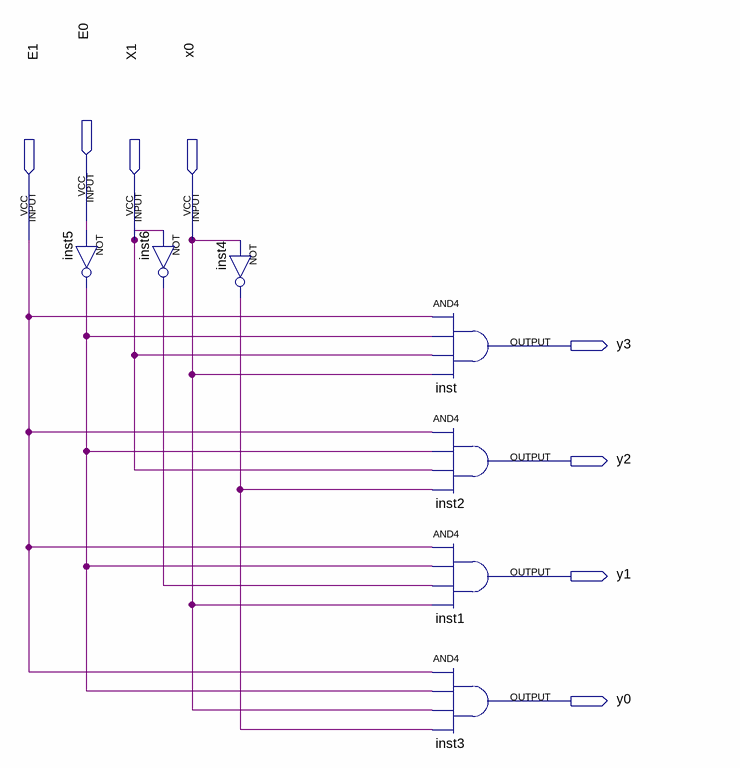
[diagram p0: schematic sheet]
// Quartus schematic Dec2_4.bdf as structural Verilog: 7 symbols, 8 pins
module Dec2_4 (
  input  E0,
  input  E1,
  input  X1,
  input  x0,
  output y3,
  output y2,
  output y1,
  output y0
);

  wire inst4_out, inst5_out, inst6_out;

  not inst5 (inst5_out, E0);
  not inst6 (inst6_out, X1);
  not inst4 (inst4_out, x0);
  and inst (y3, E1, inst5_out, X1, x0);
  and inst2 (y2, E1, inst5_out, X1, inst4_out);
  and inst1 (y1, E1, inst5_out, inst6_out, x0);
  and inst3 (y0, E1, inst5_out, x0, inst4_out);
endmodule
